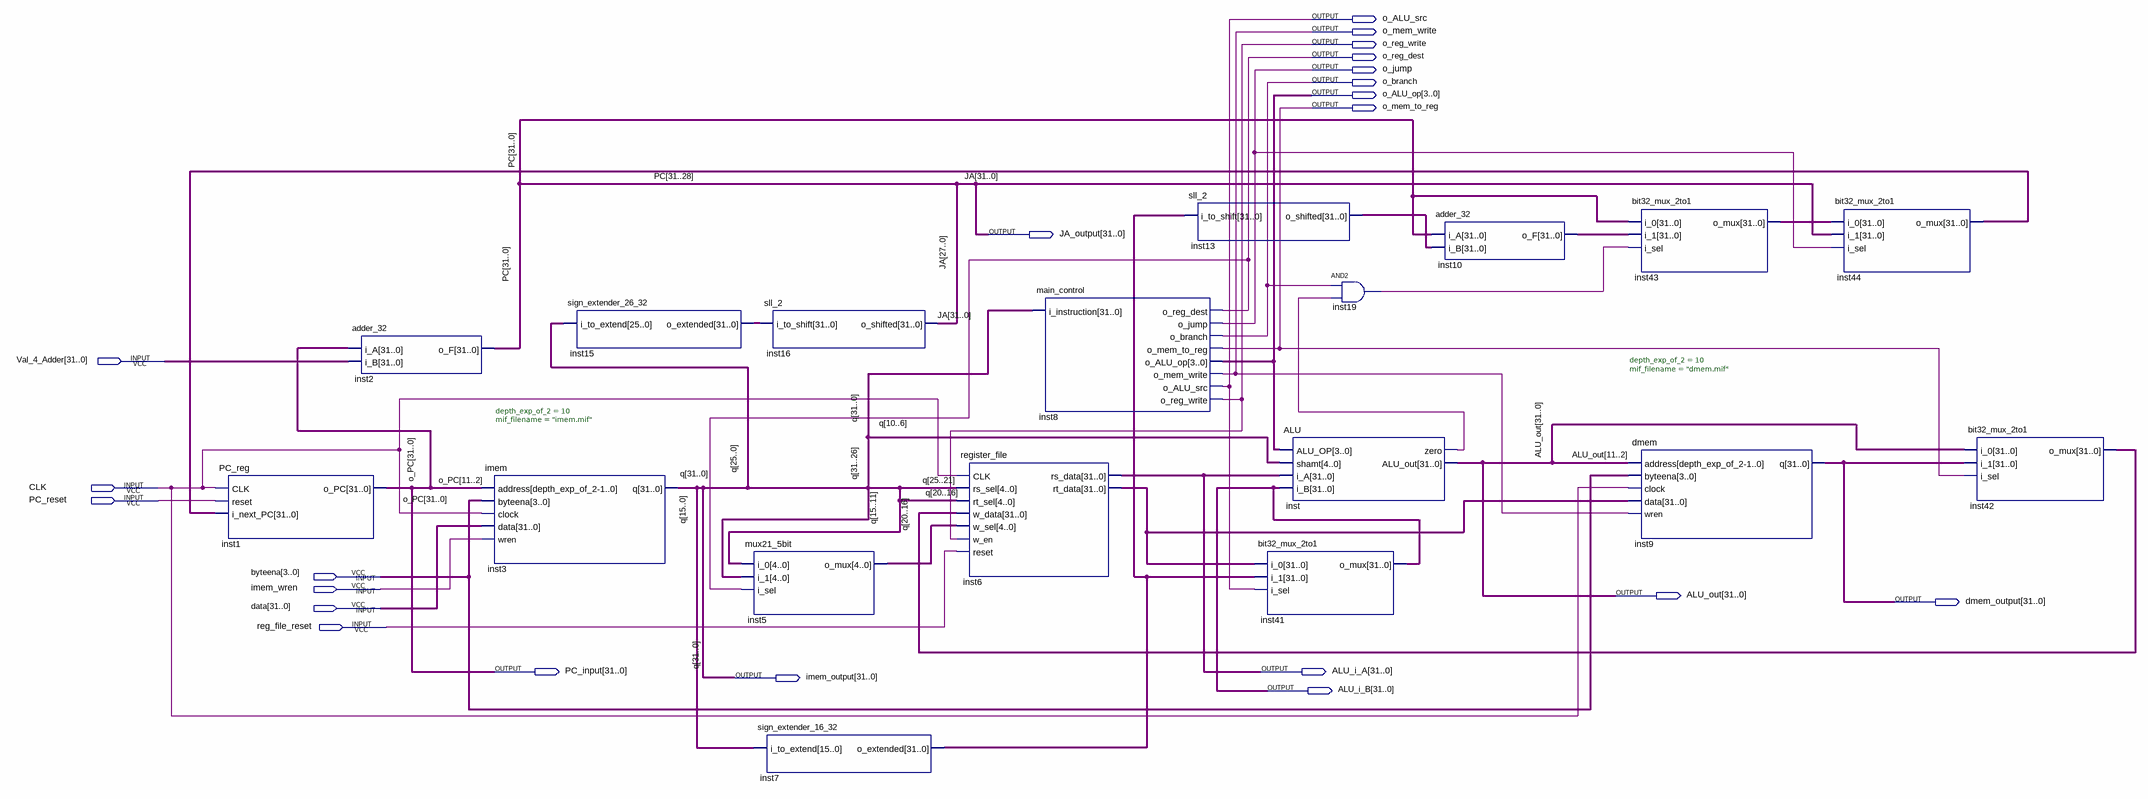
[diagram p0: schematic sheet]
// Quartus schematic ProjectA.bdf as structural Verilog: 18 symbols, 22 pins
module ProjectA (
  input  [31:0] Val_4_Adder,
  input  CLK,
  input  PC_reset,
  input  [3:0] byteena,
  input  imem_wren,
  input  [31:0] data,
  input  reg_file_reset,
  output o_ALU_src,
  output o_mem_write,
  output o_reg_write,
  output o_reg_dest,
  output o_jump,
  output o_branch,
  output [3:0] o_ALU_op,
  output o_mem_to_reg,
  output [31:0] JA_output,
  output [31:0] ALU_out,
  output [31:0] dmem_output,
  output [31:0] PC_input,
  output [31:0] ALU_i_A,
  output [31:0] imem_output,
  output [31:0] ALU_i_B
);

  wire inst19_out, inst_zero;
  wire [4:0] inst5_o_mux;
  wire [31:0] inst6_rt_data, inst7_o_extended, inst10_o_f, inst13_o_shifted, inst15_o_extended, inst42_o_mux,
       inst43_o_mux, inst44_o_mux, PC;

  PC_reg inst1 (.CLK(CLK), .reset(PC_reset), .i_next_PC(inst44_o_mux), .o_PC(PC_input));
  adder_32 inst2 (.i_A(PC_input), .i_B(Val_4_Adder), .o_F(PC));
  imem #(.depth_exp_of_2(10), .mif_filename("imem.mif")) inst3 (
    .address(PC_input[11:2]), .byteena(byteena), .clock(CLK), .data(data), .wren(imem_wren), .q(imem_output));
  sign_extender_26_32 inst15 (.i_to_extend(imem_output[25:0]), .o_extended(inst15_o_extended));
  sll_2 inst16 (.i_to_shift(inst15_o_extended), .o_shifted(JA_output));
  mux21_5bit inst5 (.i_0(imem_output[20:16]), .i_1(imem_output[15:11]), .i_sel(o_reg_dest), .o_mux(inst5_o_mux));
  sign_extender_16_32 inst7 (.i_to_extend(imem_output[15:0]), .o_extended(inst7_o_extended));
  register_file inst6 (
    .CLK(CLK), .rs_sel(imem_output[25:21]), .rt_sel(imem_output[20:16]), .w_data(inst42_o_mux),
    .w_sel(inst5_o_mux), .w_en(o_reg_write), .reset(reg_file_reset), .rs_data(ALU_i_A),
    .rt_data(inst6_rt_data));
  main_control inst8 (
    .i_instruction(imem_output), .o_reg_dest(o_reg_dest), .o_jump(o_jump), .o_branch(o_branch),
    .o_mem_to_reg(o_mem_to_reg), .o_ALU_op(o_ALU_op), .o_mem_write(o_mem_write), .o_ALU_src(o_ALU_src),
    .o_reg_write(o_reg_write));
  sll_2 inst13 (.i_to_shift(inst7_o_extended), .o_shifted(inst13_o_shifted));
  bit32_mux_2to1 inst41 (.i_0(inst6_rt_data), .i_1(inst7_o_extended), .i_sel(o_ALU_src), .o_mux(ALU_i_B));
  ALU inst (
    .ALU_OP(o_ALU_op), .shamt(imem_output[10:6]), .i_A(ALU_i_A), .i_B(ALU_i_B), .zero(inst_zero),
    .ALU_out(ALU_out));
  and inst19 (inst19_out, o_branch, inst_zero);
  adder_32 inst10 (.i_A(PC), .i_B(inst13_o_shifted), .o_F(inst10_o_f));
  bit32_mux_2to1 inst43 (.i_0(PC), .i_1(inst10_o_f), .i_sel(inst19_out), .o_mux(inst43_o_mux));
  dmem #(.depth_exp_of_2(10), .mif_filename("dmem.mif")) inst9 (
    .address(ALU_out[11:2]), .byteena(byteena), .clock(CLK), .data(inst6_rt_data), .wren(o_mem_write),
    .q(dmem_output));
  bit32_mux_2to1 inst44 (.i_0(inst43_o_mux), .i_1(JA_output), .i_sel(o_jump), .o_mux(inst44_o_mux));
  bit32_mux_2to1 inst42 (.i_0(ALU_out), .i_1(dmem_output), .i_sel(o_mem_to_reg), .o_mux(inst42_o_mux));

  // Other names for the same wires on the sheet: q[31:0] = imem_output; JA[31:0] = JA_output; o_PC[31:0] = PC_input
endmodule
